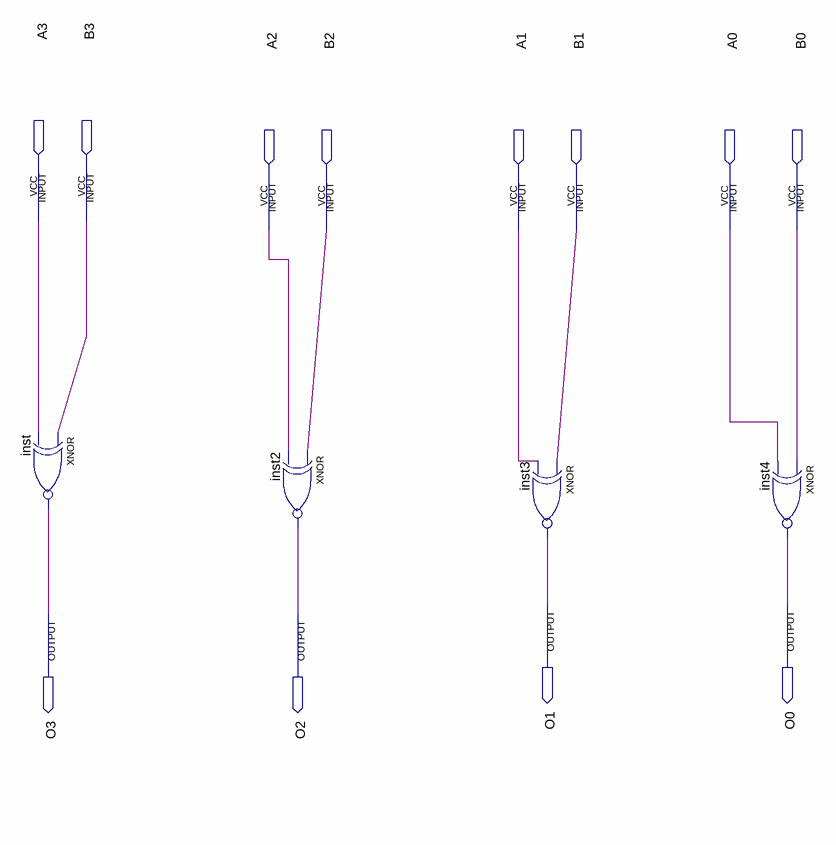
[diagram p0: schematic sheet]
// Quartus schematic XNOR_4.bdf as structural Verilog: 4 symbols, 12 pins
module XNOR_4 (
  input  A3,
  input  B3,
  input  A2,
  input  B2,
  input  A1,
  input  B1,
  input  A0,
  input  B0,
  output O1,
  output O0,
  output O3,
  output O2
);

  xnor inst (O3, B3, A3);
  xnor inst2 (O2, B2, A2);
  xnor inst3 (O1, B1, A1);
  xnor inst4 (O0, B0, A0);
endmodule
